# Altium schematic sheet JH_Con_board3.SchDoc
size A4; SheetNumber: 3; SheetTotal: 3
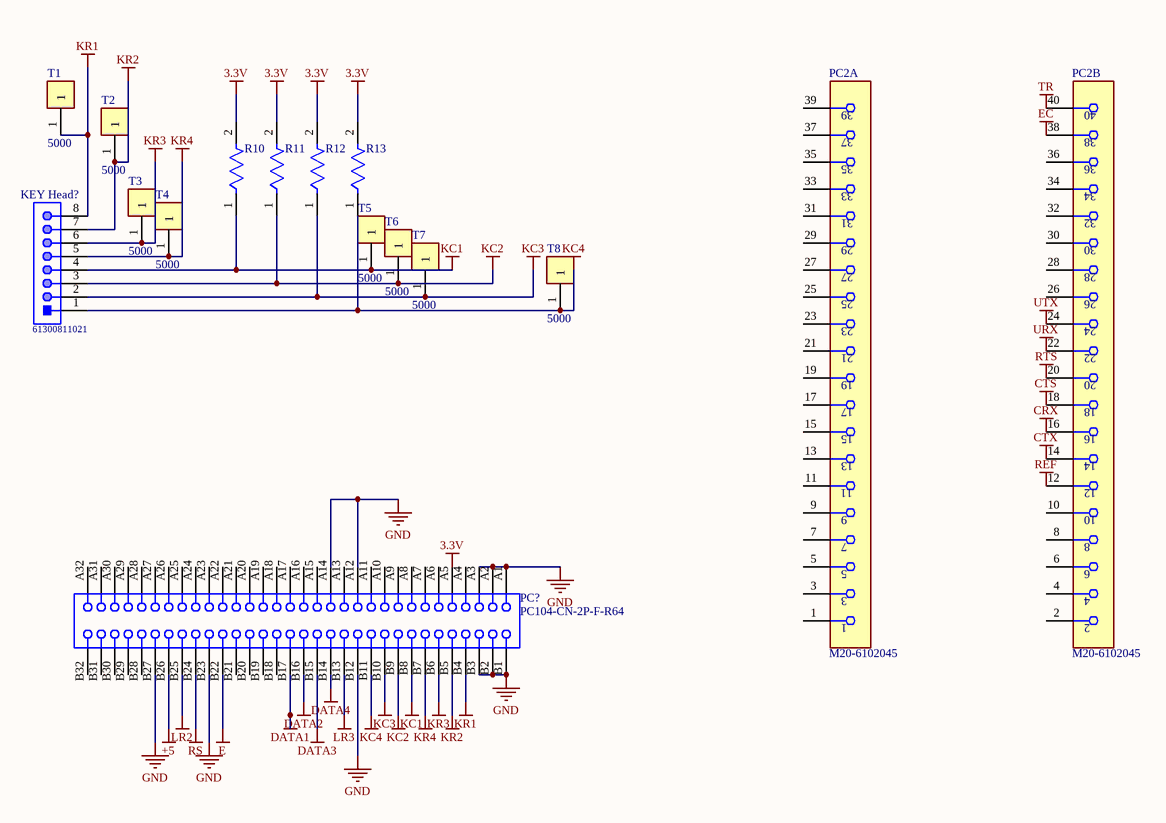
[diagram p0: JH_Con_board3.SchDoc]

## Parts
KEY_Head?  61300811021  [61300811021]
PC2  M20-6102045  [FP-M20-6102045-MFG]  (parts A,B of 2)
PC?  PC104-CN-2P-F-R64  [BTB2-54-V64F-04]
R10  CR2512-JW-472ELF  [FP-CR2512-IPC_A]  (value not drawn)
R11  CR2512-JW-472ELF  [FP-CR2512-IPC_A]  (value not drawn)
R12  CR2512-JW-472ELF  [FP-CR2512-IPC_A]  (value not drawn)
R13  CR2512-JW-472ELF  [FP-CR2512-IPC_A]  (value not drawn)
T1  5000  [FP-5000-MFG]
T2  5000  [FP-5000-MFG]
T3  5000  [FP-5000-MFG]
T4  5000  [FP-5000-MFG]
T5  5000  [FP-5000-MFG]
T6  5000  [FP-5000-MFG]
T7  5000  [FP-5000-MFG]
T8  5000  [FP-5000-MFG]

## Nets
3.3V: PC?.A5 R10.2 R11.2 R12.2 R13.2
+5: PC?.B26
CRX: PC2.16
CTS: PC2.18
CTX: PC2.14
DATA1: PC?.B17
DATA2: PC?.B16
DATA3: PC?.B15
DATA4: PC?.B14
E: PC?.B22
EC: PC2.38
GND: PC?.A1 PC?.A2 PC?.A3 PC?.A12 PC?.A14 PC?.B1 PC?.B2 PC?.B3 PC?.B12 PC?.B23 PC?.B27
KC1: KEY_Head?.4 PC?.B8 R10.1 T5.1
KC2: KEY_Head?.3 PC?.B9 R11.1 T6.1
KC3: KEY_Head?.2 PC?.B10 R12.1 T7.1
KC4: KEY_Head?.1 PC?.B11 R13.1 T8.1
KR1: KEY_Head?.8 PC?.B4 T1.1
KR2: KEY_Head?.7 PC?.B5 T2.1
KR3: KEY_Head?.6 PC?.B6 T3.1
KR4: KEY_Head?.5 PC?.B7 T4.1
LR2: PC?.B25
LR3: PC?.B13
REF: PC2.12
RS: PC?.B24
RTS: PC2.20
TR: PC2.40
URX: PC2.22
UTX: PC2.24

Not connected (* = marked no-connect by the designer): PC2 1 2 3 4 5 6 7 8 9 10 11 13 15 17 19 21 23 25 26 27 28 29 30 31 32 33 34 35 36 37 39; PC? A4(4) A6(6) A7(7) A8(8) A9(9) A10(10) A11(11) A13(13) A15(15) A16(16) A17(17) A18(18) A19(19) A20(20) A21(21) A22(22) A23(23) A24(24) A25(25) A26(26) A27(27) A28(28) A29(29) A30(30) A31(31) A32(32) B18(50) B19(51) B20(52) B21(53) B28(60) B29(61) B30(62) B31(63) B32(64)

## Library data of the parts
KEY_Head? = CMP-1502-01075-1: THT Angled Pin Header WR-PHD, Pitch 2.54 mm, Single Row, 8 pins; Manufacturer: Wurth Elektronik; Pin Number: 8; Rated Current: 3A; Working Voltage: 250VAC; Withstanding Voltage: 500VAC; Gender: Male; Contact Resistance: 20mOhm; Pitch: 2.54mm; Part Number: 61300811021; Publisher: WurthElektronik; Manufacturer URL: http://www.we-online.de; Row Number: Single; Datasheet URL: https://katalog.we-online.de/em/datasheet/6130xx11021.pdf; Orientation: Angled; Operating Temperature: -40to105degC; Mounting Technology: THT; Package Reference: 61300811021; Packaging: Bag
PC2 = CMP-15831-000080-1: CONN STKTHRU PC/104 40POS PCB; Current Rating: 3A; Pitch: 2.54mm; Insulation Resistance: 5GR; Contact Resistance: 30mR; Number of Positions: 40; Gender: Receptacle; REACH SVHC: No SVHC; Housing Material: Nylon; Number of Rows: 2; Min Operating Temperature: -55°C; Contact Plating: Gold; Orientation: Straight; Mount: Through Hole; Contact Material: Bronze; Length: 51.46mm; Weight: 0.218205oz; Number of Contacts: 40; Packaging: Rail/Tube; Depth: 5.25mm; Termination: Solder; Radiation Hardening: No; Flammability Rating: UL94 V-0; Housing Color: Black; Max Operating Temperature: 105°C; Material: Nylon; Package Quantity: 11; Color: Black; Max Current Rating: 3A; Series: M20
PC? = CMP-0001-00110-1: Board-to-Board Connector, PC104 BA ISA, Stackthrough, Vertical, 2-Row, 64-Postion, Pitch 2.54mm,  Receptacle, Height 11.05mm; Mating Connector: Harwin-M20-6103205 (stackthrough); Publisher: Altium; ClassName: Board Template Connector; Component Kind: Standard; Package Reference: BTB2-54-V64F-04
R10-R13 = CMP-1018-00090-2: Thick Film Chip Resistors 2512 4.7kΩ 1W 5% 200ppm/°C; Resistance: 4.7kR; Voltage Rating: 200V; RoHS Compliant: Yes; Max Power Dissipation: 1W; Number of Terminations: 2; Length: 0.248inch; Termination: SMD/SMT; Case/Package: 2512; Max Operating Temperature: 155°C; Series: CR2512; Package Quantity: 4000; Tolerance: 5%; Power Rating: 1W; Case Code (Metric): 6332; Temperature Coefficient: 200ppm/°C; Height: 0.03inch; Case Code (Imperial): 2512; Width: 0.122inch; Packaging: Tape and Reel; Resistor Type: Thick Film; Mount: Surface Mount; Min Operating Temperature: -55°C
T1-T8 = CMP-19636-000027-1: PC TEST POINT MINIATURE RED; Outside Diameter: 2.54mm; Body Material: Bronze; Number of Contacts: 1; Insulation: Insulated; Inside Diameter: 1.27mm; Hole Diameter: 1.6mm; Plating: Silver; Material: Nylon; Length: 7.62mm; Package Quantity: 100; Number of Ports: 1; Contact Material: Bronze; Orientation: Straight; RoHS Compliant: Yes; Housing Color: Red; Height: 0.3inch; Series: THM; Lead Free: Lead Free; Color: Red; Contact Plating: Tin; Mount: PCB; Packaging: Bulk; REACH SVHC: No SVHC; Flammability Rating: UL94 V-0